# Altium schematic sheet integratorLoop.SchDoc
size A4
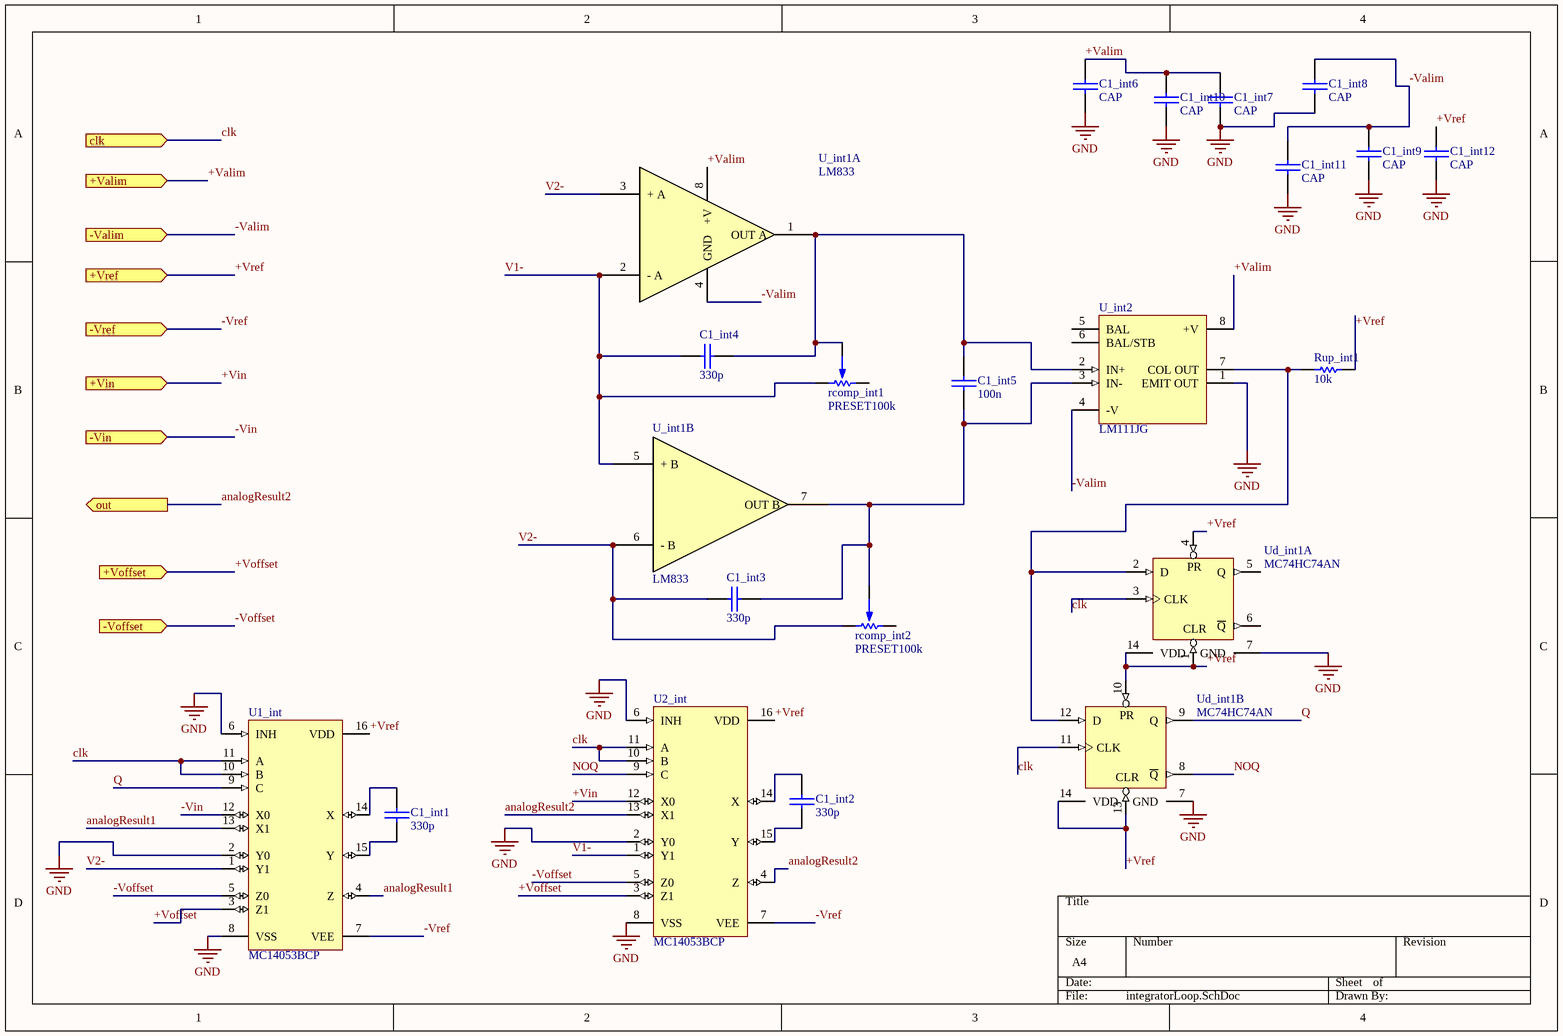
[diagram p0: integratorLoop.SchDoc]

## Parts
C1_int1  330p  [CAP200]
C1_int2  330p  [CAP200]
C1_int3  330p  [CAP200]
C1_int4  330p  [CAP200]
C1_int5  100n  [CAP200]
C1_int6  CAP  [CAP200]
C1_int7  CAP  [CAP200]
C1_int8  CAP  [CAP200]
C1_int9  CAP  [CAP200]
C1_int10  CAP  [CAP200]
C1_int11  CAP  [CAP200]
C1_int12  CAP  [CAP200]
rcomp_int1  PRESET100k  [PRESET V]
rcomp_int2  PRESET100k  [PRESET V]
Rup_int1  10k  [RES300]
U1_int  MC14053BCP  [648-08]
U2_int  MC14053BCP  [648-08]
U_int1  LM833  [DIP8]  (parts A,B of 2)
U_int2  LM111JG  [JG008]
Ud_int1  MC74HC74AN  [646-06]  (parts A,B of 2)

## Ports
+Valim (in), +Vin (in), +Voffset (in), +Vref (in), -Valim (in), -Vin (in), -Voffset (in), -Vref (in), clk (in), out (out)

## Nets
GND: C1_int6.2 C1_int7.2 C1_int8.2 C1_int9.2 C1_int10.2 C1_int11.2 C1_int12.2 U1_int.2(Y0) U1_int.6(INH) U1_int.8(VSS) U2_int.2(Y0) U2_int.6(INH) U2_int.8(VSS) U_int2.1(EMIT_OUT) Ud_int1.7(GND)
+Valim: C1_int6.1 C1_int7.1 C1_int10.1 U_int1.8(+V) U_int2.8(+V) ; port +Valim
+Vin: U2_int.12(X0) ; port +Vin
+Voffset: U1_int.3(Z1) U2_int.3(Z1) ; port +Voffset
+Vref: C1_int12.1 Rup_int1.2 U1_int.16(VDD) U2_int.16(VDD) Ud_int1.1(CLR) Ud_int1.4(PR) Ud_int1.10(PR) Ud_int1.13(CLR) Ud_int1.14(VDD) ; port +Vref
-Valim: C1_int8.1 C1_int9.1 C1_int11.1 U_int1.4(GND) U_int2.4(-V) ; port -Valim
-Vin: U1_int.12(X0) ; port -Vin
-Voffset: U1_int.5(Z0) U2_int.5(Z0) ; port -Voffset
-Vref: U1_int.7(VEE) U2_int.7(VEE) ; port -Vref
analogResult1: U1_int.4(Z) U1_int.13(X1)
analogResult2: U2_int.4(Z) U2_int.13(X1) ; port out
clk: U1_int.10(B) U1_int.11(A) U2_int.10(B) U2_int.11(A) Ud_int1.3(CLK) Ud_int1.11(CLK) ; port clk
NOQ: U2_int.9(C) Ud_int1.8(~{Q})
Q: U1_int.9(C) Ud_int1.9(Q)
V1-: C1_int4.1 rcomp_int1.1 U2_int.1(Y1) U_int1.2(-_A) U_int1.5(+_B)
V2-: C1_int3.1 rcomp_int2.1 U1_int.1(Y1) U_int1.3(+_A) U_int1.6(-_B)
NetC1_int1_1: C1_int1.1 U1_int.14(X)
NetC1_int1_2: C1_int1.2 U1_int.15(Y)
NetC1_int2_1: C1_int2.1 U2_int.14(X)
NetC1_int2_2: C1_int2.2 U2_int.15(Y)
NetC1_int3_2: C1_int3.2 C1_int5.2 rcomp_int2.2 U_int1.7(OUT_B) U_int2.3(IN-)
NetC1_int4_2: C1_int4.2 C1_int5.1 rcomp_int1.2 U_int1.1(OUT_A) U_int2.2(IN+)
NetRup_int1_1: Rup_int1.1 U_int2.7(COL_OUT) Ud_int1.2(D) Ud_int1.12(D)

Not connected (* = marked no-connect by the designer): rcomp_int1 3; rcomp_int2 3; U_int2 5(BAL) 6(BAL/STB); Ud_int1 5(Q) 6(~{Q})

## Library data of the parts
C1_int1-C1_int5 = CAP
rcomp_int1 rcomp_int2 = PRESET
Rup_int1 = RES
U1_int U2_int = MC14053BCP: Triple 2-Channel Analog Multiplexer/Demultiplexer; Published: 15-Apr-2002; DatasheetVersion: 1995; PackageVersion: Apr-2000; PackageReference: 648-08; Publisher: Altium Limited; PackageDescription: DIP; 16 Leads; Row Spacing 7.62 mm; Pitch 2.54 mm; Code_JEDEC: MS-001-BB; ComponentLink1Description: Manufacturer Link; ComponentLink1URL: http://www.onsemi.com/; ComponentLink2Description: Datasheet; ComponentLink2URL: http://www.onsemi.com/pub/Collateral/MC14051B-D.PDF
U_int1 = LM833: Dual Audio Operational Amplifier
U_int2 = LM111JG: Differential Comparator with Strobe; Published: 16-Jan-2001; LatestRevisionDate: 04-Mar-2005; LatestRevisionNote: Stylized 3D Model Added.; DatasheetVersion: Feb-1992; PackageVersion: Jan-1995; PackageReference: JG008; Publisher: Altium Limited; PackageDescription: DIP; 8 Leads; Row Spacing 7.62 mm; Pitch 2.54 mm; ComponentLink1Description: Manufacturer Link; ComponentLink1URL: http://www.ti.com/; ComponentLink2Description: Datasheet; ComponentLink2URL: http://www-s.ti.com/sc/ds/lm111.pdf
Ud_int1 = MC74HC74AN: Dual D-Type Flip-Flop with Set and Reset; Published: 15-Apr-2002; DatasheetVersion: Mar-2000; PackageVersion: 1995; PackageReference: 646-06; Publisher: Altium Limited; PackageDescription: DIP; 14 Leads; Row Spacing 7.62 mm; Pitch 2.54 mm; ComponentLink1Description: Manufacturer Link; ComponentLink1URL: http://www.onsemi.com/; ComponentLink2Description: Datasheet; ComponentLink2URL: http://www.onsemi.com/pub/Collateral/MC74HC74A-D.PDF